# Altium project rovables_expansion.PrjPcb
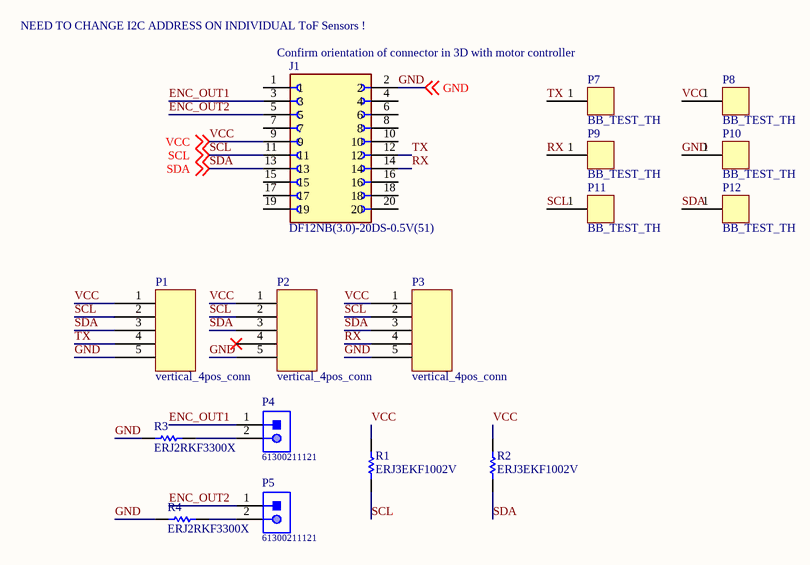
[diagram p0: expansion.SchDoc]
1 sheet, 16 parts. Net scope: global (net labels, ports and power ports of the same name join across sheets).
Board file: expansion.PcbDoc

## Sheet expansion.SchDoc
size A; SheetNumber: 1; SheetTotal: 1

### Parts
J1  DF12NB(3.0)-20DS-0.5V(51)  [HRS_DF12NB(3.0)-20DS-0.5V(51)]
P1  vertical_4pos_conn  [vertical_4pos_conn _s_square]
P2  vertical_4pos_conn  [vertical_4pos_conn _s_square]
P3  vertical_4pos_conn  [vertical_4pos_conn _s_square]
P4  61300211121  [61300211121]
P5  61300211121  [61300211121]
P7  BB_TEST_TH  [BB_WIRE_TEST_TH]
P8  BB_TEST_TH  [BB_WIRE_TEST_TH]
P9  BB_TEST_TH  [BB_WIRE_TEST_TH]
P10  BB_TEST_TH  [BB_WIRE_TEST_TH]
P11  BB_TEST_TH  [BB_WIRE_TEST_TH]
P12  BB_TEST_TH  [BB_WIRE_TEST_TH]
R1  ERJ3EKF1002V  [RESC1609X55X30LL15T15]
R2  ERJ3EKF1002V  [RESC1609X55X30LL15T15]
R3  ERJ2RKF3300X  [RESC1005X40X25ML05T05]
R4  ERJ2RKF3300X  [RESC1005X40X25ML05T05]

### Nets
ENC_OUT1: J1.3 P4.1
ENC_OUT2: J1.5 P5.1
GND: J1.2 P1.5 P2.5 P3.5 P10.1 R3.1 R4.1 ; off-sheet GND
RX: J1.14 P3.4 P9.1
SCL: J1.11 P1.2 P2.2 P3.2 P11.1 R1.1 ; off-sheet SCL
SDA: J1.13 P1.3 P2.3 P3.3 P12.1 R2.1 ; off-sheet SDA
TX: J1.12 P1.4 P7.1
VCC: J1.9 P1.1 P2.1 P3.1 P8.1 R1.2 R2.2 ; off-sheet VCC
NetP4_2: P4.2 R3.2
NetP5_2: P5.2 R4.2

Not connected (* = marked no-connect by the designer): J1 1 4 6 7 8 10 15 16 17 18 19 20; P2 4*

### Notes on the sheet
- NEED TO CHANGE I2C ADDRESS ON INDIVIDUAL ToF Sensors !
- Confirm orientation of connector in 3D with motor controller

### Library data of the parts
P4 P5 = CMP-1712-00002-4: THT Vertical Pin Header WR-PHD, Pitch 2.54 mm, Single Row, 2 pins; Manufacturer: Wurth Elektronik; Rated Current: 3A; Gender: Male; Withstanding Voltage: 500VAC; Working Voltage: 250VAC; Pitch: 2.54mm; Contact Resistance: 20mOhm; Pin Number: 2; Mounting Technology: THT; Orientation: Vertical; Operating Temperature: -40to105degC; Packaging: Bag; Publisher: WurthElektronik; Datasheet URL: https://katalog.we-online.de/em/datasheet/6130xx11121.pdf; Manufacturer URL: http://www.we-online.de; Row Number: Single; Package Reference: 61300211121; Part Number: 61300211121
R1 R2 = CMP-1012-00623-3: Chip Resistor, 10 KOhm, +/- 1%, 0.1 W, -55 to 155 degC, 0603 (1608 Metric), RoHS, Tape and Reel; Manufacturer: Panasonic; Voltage Rating: 75V; Case\/Package: 0603; Power Rating: 100mW; Resistance: 10KOhm; Temperature Coefficient: 100ppm\/degreesC; Number of Pins: 2; Package Reference: 603; Depth: 0.8mm; Mount: SurfaceMount; Package Description: 2-Pin Surface Mount Device, Body 1.6 x 0.85 mm; Datasheet Version: 02/2017; Length: 1.6mm; Lead Free: LeadFree; Height: 0.45mm; Number of Terminations: 2; Max Power Dissipation: 100mW; Min Operating Temperature: -55degC; Datasheet URL: https://industrial.panasonic.com/cdbs/www-data/pdf/RDA0000/AOA0000C304.pdf; Termination: SMD/SMT; Case Code (Metric): 1608; Case Code (Imperial): 0603; Tolerance: 1%; Max Operating Temperature: 155degC; RoHSCompliant: true; Voltage Rating (DC): 75V; Radiation Hardening: No; Packaging: TapeandReel; Composition: ThickFilm; Mounting Technology: SurfaceMount; Manufacturer URL: http://www.panasonic.com/; Width: 0.031inch; REACH SVHC: NoSVHC; Contact Plating: Tin; Military Standard: Not; Package Quantity: 1
R3 R4 = CMP-2002-01143-1: Manufacturer: Panasonic; Part Number: ERJ2RKF3300X
J1 = DF12NB(3.0)-20DS-0.5V(51): Value: *; Availability: Unavailable; Package: None; Price: None; MP: DF12NB(3.0)-20DS-0.5V(51)